# EAGLE design resistive-probe-adapter_v2 (EAGLE 9.4.2)
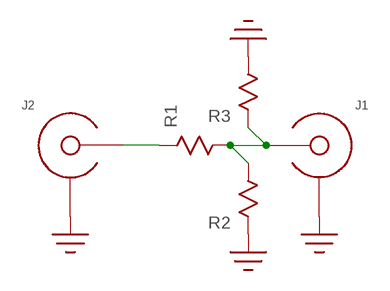
[diagram p0: schematic, sheet 1]

## Parts
J1  SMA-EDGE-LAUNCH4020_TAPER  [SMA_EDGE_LAUNCH_2L_4020_TAPER]
J2  SMA-EDGE-LAUNCH4020_TAPER  [SMA_EDGE_LAUNCH_2L_4020_TAPER]
R1  R0603  [R0603]
R2  R0603  [R0603]
R3  R0603  [R0603]

## Nets
GND: J1.BOTTOM_GND(SHIELD) J1.GND@1(SHIELD) J1.GND@2(SHIELD) J1.GND@3(SHIELD) J1.GND@4(SHIELD) J1.GND@5(SHIELD) J1.GND@6(SHIELD) J1.GND@7(SHIELD) J1.GND@8(SHIELD) J1.GND@14(SHIELD) J1.GND@15(SHIELD) J1.GND@16(SHIELD) J1.GND@17(SHIELD) J1.GND_PAD1(SHIELD) J1.GND_PAD2(SHIELD) J1.P$1(SHIELD) J1.P$2(SHIELD) J2.BOTTOM_GND(SHIELD) J2.GND@1(SHIELD) J2.GND@2(SHIELD) J2.GND@3(SHIELD) J2.GND@4(SHIELD) J2.GND@5(SHIELD) J2.GND@6(SHIELD) J2.GND@7(SHIELD) J2.GND@8(SHIELD) J2.GND@14(SHIELD) J2.GND@15(SHIELD) J2.GND@16(SHIELD) J2.GND@17(SHIELD) J2.GND_PAD1(SHIELD) J2.GND_PAD2(SHIELD) J2.P$1(SHIELD) J2.P$2(SHIELD) R2.P$1 R3.P$2
N$1 [29-6]: J2.CENTER@1(CENTER) R1.P$1
N$2 [29-6]: J1.CENTER@1(CENTER) R1.P$2 R2.P$2 R3.P$1

## Library data of the parts
J1 J2 = yapo:SMA-EDGE-LAUNCH
R1-R3 = yapo:R

## Net classes
1 29-6: width 0.737 mm, clearance 0.152 mm

## Board
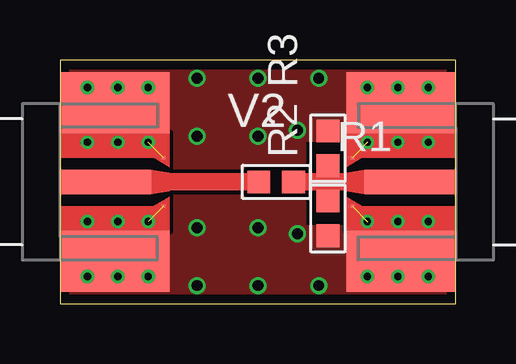
[diagram p1: board, top side]
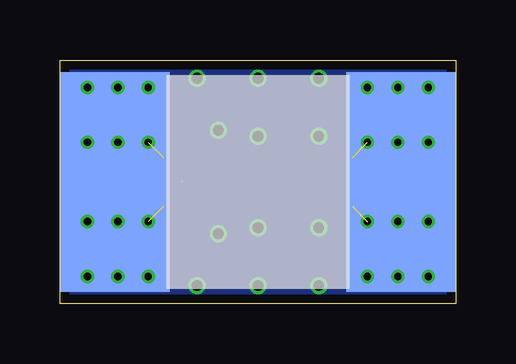
[diagram p2: board, bottom side, seen from below]

Size 16.51 x 10.16 mm. Coordinates in mm from the lower left corner, seen from the top.
Outline: 0,0 16.51,0 16.51,10.16 0,10.16 0,0
Copper layers (1*16): Top 0.035559375mm / dielectric 1.6mm / Bottom 0.035559375mm
Design rules "oshpark-2layer *": minimum track width 6mil, minimum drill 10mil, track to track 6mil, track to pad 6mil, pad to pad 6mil, via to via 6mil, smd to smd 6mil, copper to edge 15mil, drill to drill 6mil, minimum pad ring 5mil, minimum via ring 5mil, stop-mask expansion 2.5mil, vias tented up to drill 20mil, thermal gap 10mil

### Footprints (pad centres in the part's own frame; a part is rotated, then mirrored left to right if it is on the bottom)
SMA_EDGE_LAUNCH_2L_4020_TAPER = smd 4.572 x 9.144 bottom: BOTTOM_GND 2.286,0 | smd 3.81 x 1.016: CENTER@1 1.905,0 | drill 0.3: GND@1 1.143,3.937; GND@2 3.683,3.937; GND@3 1.143,1.651; GND@4 3.683,1.651; GND@5 1.143,-1.651; GND@6 3.683,-1.651; GND@7 1.143,-3.937; GND@8 3.683,-3.937; GND@14 2.413,3.937; GND@15 2.413,-3.937; GND@16 2.413,-1.651; GND@17 2.413,1.651 | smd 4.572 x 2.54: GND_PAD1 2.286,3.302; GND_PAD2 2.286,-3.302 | smd 0.127 x 0.127: P$1 4.318,1.016; P$2 4.318,-1.016
R0603 = smd 0.95 x 0.95: P$1 -0.725,0; P$2 0.725,0

### Placement (x,y rotation side)
J1  16.51,5.08 180 top
J2  0,5.08 0 top
R1  9.02,5.08 0 top
R2  11.18,3.56 90 top
R3  11.18,6.48 90 top

### Tracks (layer width: path | path; a pad name or v marks a point on that pad's centre or on a via)
GND  (via drill 0.45)  (4 unrouted)
  other vias: 5.71,9.4 8.26,9.4 5.71,6.99 8.26,6.99 5.71,3.17 8.26,3.17 5.71,0.76 8.26,0.76 10.79,9.4 9.91,7.24 9.91,2.92 10.79,0.76
  pour Top (no thermals): 0,0 16.51,0 16.51,10.16 0,10.16
  pour Bottom (no thermals): 0,0 16.51,0 16.51,10.16 0,10.16
  cutout Top: 7.75,5.84 7.75,4.32 10.67,4.32 10.67,5.84
  cutout Top: 10.29,6.73 10.29,3.3 11.94,3.3 11.94,6.73
N$1
  Top 0.737: J2.CENTER@1 R1.P$1
N$2  (1 unrouted)
  Top 0.737: J1.CENTER@1 11.43,5.08 | 11.18,5.08 R2.P$2 | 11.42,5.08 11.18,5.08 | 11.18,5.08 R1.P$2 | 11.23,5.75 R3.P$1 11.18,5.08

### Text on the board
tPlace: V2